# EAGLE design okinesio_v03 (EAGLE 7.5.0)
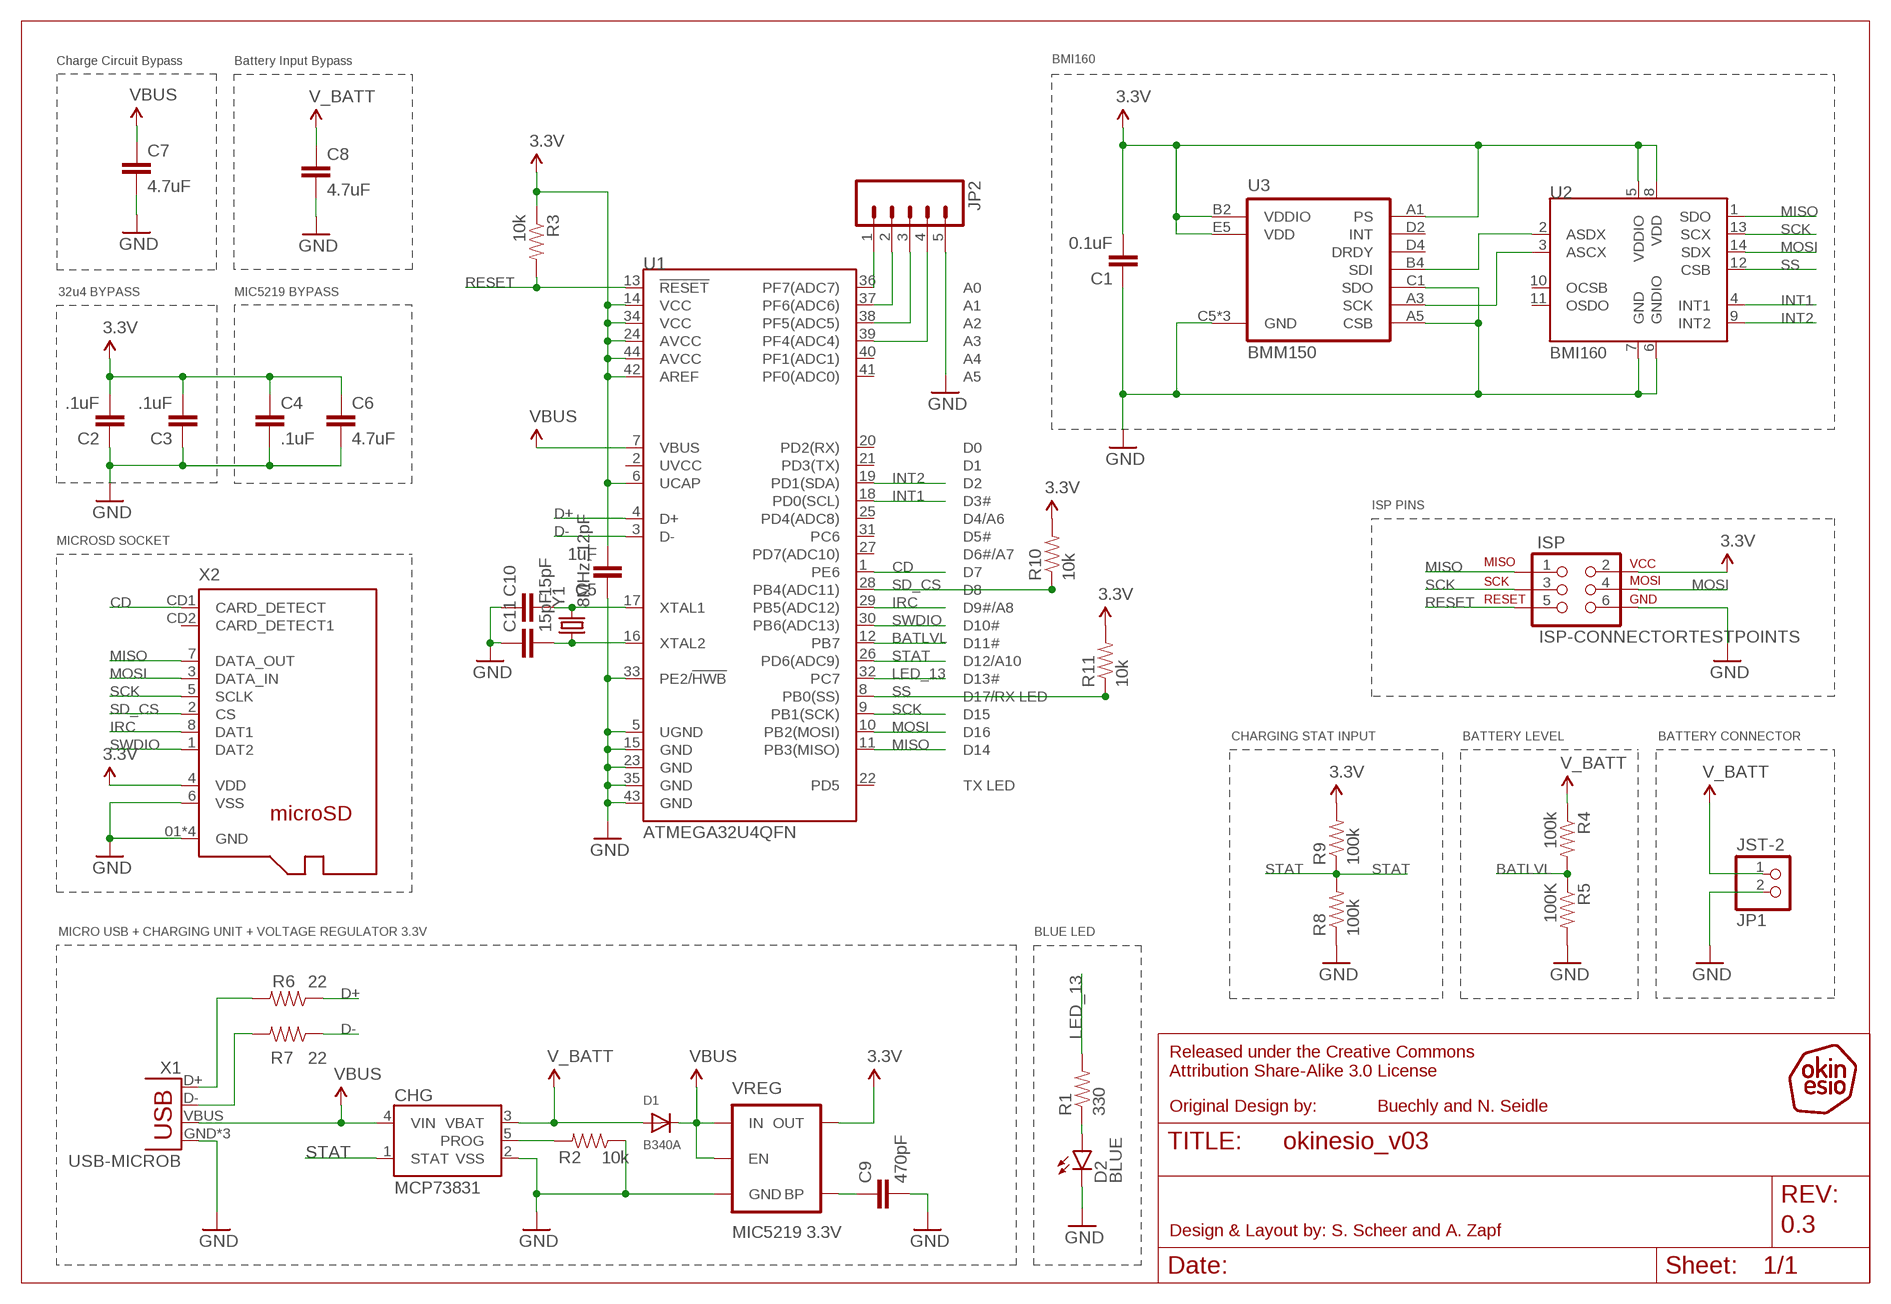
[diagram p0: schematic, sheet 1]

## Parts
C1  0.1uF  CAP0603-CAP  [0603-CAP]
C2  .1uF  CAP0603-CAP  [0603-CAP]
C3  .1uF  CAP0603-CAP  [0603-CAP]
C4  .1uF  CAP0603-CAP  [0603-CAP]
C5  1uF  CAP0603-CAP  [0603-CAP]
C6  4.7uF  CAP0603-CAP  [0603-CAP]
C7  4.7uF  CAP0805  [0805]
C8  4.7uF  CAP0805  [0805]
C9  470pF  CAP0603-CAP  [0603-CAP]
C10  15pF  CAP0603-CAP  [0603-CAP]
C11  15pF  CAP0603-CAP  [0603-CAP]
CHG  MCP73831  [SOT23-5]
D1  B340A  DIODESOD-123  [SOD-123]
D2  BLUE  LED-BLUE0603  [LED-0603]
ISP  ISP-CONNECTORTESTPOINTS  [2X3_TEST_POINTS]
JP1  JST-2  JST_2PIN-THM-RA  [JST-PH-2-THM-RA]
JP2  M05PTH  [1X05]
R1  330  RESISTOR0603  [0603-RES]
R2  10k  RESISTOR0603-RES  [0603-RES]
R3  10k  RESISTOR0603-RES  [0603-RES]
R4  100k  RESISTOR0603-RES  [0603-RES]
R5  100K  RESISTOR0603-RES  [0603-RES]
R6  22  RESISTOR0603-RES  [0603-RES]
R7  22  RESISTOR0603-RES  [0603-RES]
R8  100k  RESISTOR0603-RES  [0603-RES]
R9  100k  RESISTOR0603-RES  [0603-RES]
R10  10k  RESISTOR0603-RES  [0603-RES]
R11  10k  RESISTOR0603-RES  [0603-RES]
U1  ATMEGA32U4QFN  [QFN-44]
U2  BMI160LGA14  [LGA14-BMI160]
U3  BMM150  [WLCSP12-1.56X1.56]
U$4  OKINESIO-LOGO-2.85X2.81MM  [LOGO-STANDARD]
VREG  MIC5219 3.3V  V_REG_MIC52193.3V  [SOT23-5]
X1  USB-MICROB  [USB-MICROB]
X2  MICROSD-SOCKET  [MICROSD-SOCKET]
Y1  8MHz, 12pF  CRYSTALTXC-7A  [CRYSTAL-TXC-7A]

## Nets
3.3V: C1.2 C2.2 C3.2 C4.1 C5.2 C6.1 ISP.2 R3.1 R9.2 R10.2 R11.2 U1.6(UCAP) U1.14(VCC) U1.24(AVCC) U1.34(VCC) U1.42(AREF) U1.44(AVCC) U2.5(VDDIO) U2.8(VDD) U3.A1(PS) U3.B2(VDDIO) U3.E5(VDD) VREG.5(OUT) X2.4(VDD)
5V: C7.1 CHG.4(VIN) D1.C U1.7(VBUS) VREG.1(IN) VREG.3(EN) X1.VBUS ; supply symbol labelled VBUS
BATLVL: R4.2 R5.1 U1.12(PB7)
CD: U1.1(PE6) X2.CD1(CARD_DETECT)
D+: R6.1 U1.4(D+)
D-: R7.1 U1.3(D-)
GND: C1.1 C2.1 C3.1 C4.2 C5.1 C6.2 C7.2 C8.2 C9.2 C10.1 C11.1 CHG.2(VSS) D2.C ISP.6 JP1.2 JP2.5 R2.1 R5.2 R8.1 U1.5(UGND) U1.15(GND) U1.23(GND) U1.33(PE2/!HWB) U1.35(GND) U1.43(GND) U2.6(GNDIO) U2.7(GND) U3.A5(CSB) U3.C1(SDO) U3.C5(GND) U3.E1(GND) U3.E3(GND) VREG.2(GND) X1.GND X1.MT1(GND) X1.MT2(GND) X2.01(GND) X2.02(GND) X2.03(GND) X2.04(GND) X2.6(VSS)
INT1: U1.18(PD0(SCL)) U2.4(INT1)
INT2: U1.19(PD1(SDA)) U2.9(INT2)
IRC: U1.29(PB5(ADC12)) X2.8(DAT1)
LED_13: R1.2 U1.32(PC7)
MISO: ISP.1 U1.11(PB3(MISO)) U2.1(SDO) X2.7(DATA_OUT)
MOSI: ISP.4 U1.10(PB2(MOSI)) U2.14(SDX) X2.3(DATA_IN)
N$1: U2.2(ASDX) U3.B4(SDI)
N$2: JP2.1 U1.36(PF7(ADC7))
N$3: JP2.2 U1.37(PF6(ADC6))
N$4: JP2.3 U1.38(PF5(ADC5))
N$5: C10.2 U1.17(XTAL1) Y1.P$2
N$6: JP2.4 U1.39(PF4(ADC4))
N$7: D2.A R1.1
N$8: U2.3(ASCX) U3.A3(SCK)
N$12: CHG.5(PROG) R2.2
N$15: C9.1 VREG.4(BP)
N$18: C11.2 U1.16(XTAL2) Y1.P$1
N$19: R7.2 X1.D-
N$20: R6.2 X1.D+
RESET: ISP.5 R3.2 U1.13(!RESET)
SCK: ISP.3 U1.9(PB1(SCK)) U2.13(SCX) X2.5(SCLK)
SD_CS: R10.1 U1.28(PB4(ADC11)) X2.2(CS)
SS: R11.1 U1.8(PB0(SS)) U2.12(CSB)
STAT: CHG.1(STAT) R8.2 R9.1 U1.26(PD6(ADC9))
SWDIO: U1.30(PB6(ADC13)) X2.1(DAT2)
V_BATT: C8.1 CHG.3(VBAT) D1.A JP1.1 R4.1
Unconnected: U1.2(UVCC) U1.20(PD2(RX)) U1.21(PD3(TX)) U1.22(PD5) U1.25(PD4(ADC8)) U1.27(PD7(ADC10)) U1.31(PC6) U1.40(PF1(ADC1)) U1.41(PF0(ADC0)) U2.10(OCSB) U2.11(OSDO) U3.D2(INT) U3.D4(DRDY) X2.CD2(CARD_DETECT1)

## Notes on the sheet
- Charge Circuit Bypass | Battery Input Bypass | BMI160
- 32u4 BYPASS | MIC5219 BYPASS
- ISP PINS
- MICROSD SOCKET
- CHARGING STAT INPUT | BATTERY LEVEL | BATTERY CONNECTOR
- MICRO USB + CHARGING UNIT + VOLTAGE REGULATOR 3.3V | BLUE LED
- Released under the Creative Commons
  Attribution Share-Alike 3.0 License
- Original Design by: | Buechly and N. Seidle
- Design & Layout by: S. Scheer and A. Zapf | 0.3

## Library data of the parts
C1 C4 C6-C8 C10 C11 = SparkFun-Capacitors:CAP: Capacitor Standard 0603 ceramic capacitor, and 0.1" leaded capacitor.
C2 = SparkFun-Passives:CAP: Capacitor Standard 0603 ceramic capacitor, and 0.1" leaded capacitor.; PROD_ID: CAP-00810
C3 = SparkFun-Passives:CAP: Capacitor Standard 0603 ceramic capacitor, and 0.1" leaded capacitor.; PROD_ID: CAP-08280
C5 = SparkFun-Passives:CAP: Capacitor Standard 0603 ceramic capacitor, and 0.1" leaded capacitor.; PROD_ID: CAP-00868
C9 = SparkFun-Passives:CAP: Capacitor Standard 0603 ceramic capacitor, and 0.1" leaded capacitor.; PROD_ID: CAP-07884
CHG = SparkFun-PowerIC:MCP73831: Miniature single cell, fully integrated Li-Ion, Li-polymer charge management controller http://ww1.microchip.com/downloads/en/DeviceDoc/20001984g.pdf IC-09995; PROD_ID: IC-09995
D1 = adafruit:DIODE: Diode SMADIODE - SMA Surface Mount Package 20V 1A Schottky Diode Digikey: 641-1014-6-ND DO-1N4148 - Through Hole Small Current Diode SOD-123 20V 1 A (.5mV Vf) Schottky Diode - Digikey: MBRX120TPMSCT-ND SOD-323 10V 570mA (.38mV Vf, 3ns) Schottky Diode - Digikey: ZLLS410CT-ND SOD-523 30V 30mA Schottky Diode (RB751S-40TE61) - Digikey: RB751S-40TE61CT-ND SOT23-R/W - SOT23 Package (R = Solder Paste/Reflow Ovens, W = Hand-Soldering) BAT54Film 40V 300mA - Digikey: 497-7162-1-ND; PROD_ID: DIO-09886
D2 = SparkFun-LED:LED-BLUE: Blue LEDs for production use Various blue LEDs stocked by SparkFun production 0603 - DIO-08575 Rebel - DIO-09553 1206 - DIO-09911; PROD_ID: DIO-08575
ISP = okinesio:ISP-CONNECTOR: AVR ISP 6 Pin A reduced ISP connector for AVR programming. Common on Arduino. This footprint will take up less PCB space. **Special note about "TEST_POINT" package. The stop mask is on the top side, so if you want your programming test points to be on the bottom of your board, make sure to place this package on the bottom side of the board. This also ensure that the orientation to program from the bottom side will be correct. Modified by okinesio. Original design by Sparkfun.com (SparkFun-Connectors.lbr)
JP1 = adafruit:JST_2PIN: JST 2-Pin Connectors of various flavors SMT-RA (S2B-PH-SM4) 4UConnector #17311 SMT (B2B-PH-SM4) THM-RA (S2B-PH) THM (B2B-PH); PROD_ID: CONN-08352
JP2 = SparkFun-Connectors:M05: Header 5 Standard 5-pin 0.1" header. Use with straight break away headers (SKU : PRT-00116), right angle break away headers (PRT-00553), swiss pins (PRT-00743), machine pins (PRT-00117), and female headers (PRT-00115). Molex polarized connector foot print use with SKU : PRT-08230 with associated crimp pins and housings.
R1 = SparkFun-Resistors:RESISTOR: Resistor Basic schematic elements and footprints for 0603, 1206, and PTH resistors.
R2 R3 = SparkFun-Passives:RESISTOR: Resistor Basic schematic elements and footprints for 0603, 1206, and PTH resistors.; PROD_ID: RES-00824
R4 R5 R8-R11 = SparkFun-Passives:RESISTOR: Resistor Basic schematic elements and footprints for 0603, 1206, and PTH resistors.
R6 R7 = SparkFun-Passives:RESISTOR: Resistor Basic schematic elements and footprints for 0603, 1206, and PTH resistors.; PROD_ID: RES-08698
U1 = okinesio:ATMEGA32U4: Atmel 44-pin 8-bit Microcontroller with 32KBytes of ISP Flash and USB Controller
U2 = bosch-sensortec:BMI160: BMI160 Internal Measurement Unit
U3 = bosch-sensortec:BMM150: The BMM150 is a standalone geomagnetic sensor for consumer market applications. It allows measurements of the magnetic field in three perpendicular axes. Based on Bosch’s proprietary FlipCore technology, performance and features of BMM150 are carefully tuned and perfectly match the demanding requirements of all 3-axis mobile applications such as electronic compass, navigation or augmented reality. The library has been designed by Richard Magdycz <https://www.facebook.com/groups/eaglecadsoftUK>
U$4 = okinesio:OKINESIO-LOGO
VREG = SparkFun-PowerIC:V_REG_MIC5219: V_REG MIC5219 Standard 3.3V and 5V 500mA LDO voltage regulator in SOT-23 layout. Micrel part MIC5219. BP (by-pass) pin is used to lower output noise with 470pF cap, may be left open.; PROD_ID: VREG-09872
X1 = SparkFun-Connectors:USB: USB Connectors USB-B-PTH is fully proven SKU : PRT-00139/CONN-08278 USB-miniB is fully proven SKU : PRT-00587 USB-A-PCB is untested. USB-A-H is throughly reviewed, but untested. Spark Fun Electronics SKU : PRT-00437 USB-B-SMT is throughly reviewed, but untested. Needs silkscreen touching up. USB-A-S has not been used/tested USB-MB-H has not been used/tested USB-MICROB has been used. CONN-09505; PROD_ID: CONN-09505
X2 = okinesio:MICROSD-SOCKET: MOLEX 104031-0811 - microSD socket (compact dimensions) 1.10mm Pitch Push-Pull Type 1.42mm Height with Detect Switch Mouser: 538-104031-0811
Y1 = SparkFun-FreqCtrl:CRYSTAL: Various standard crystals. Proven footprints.

## Board
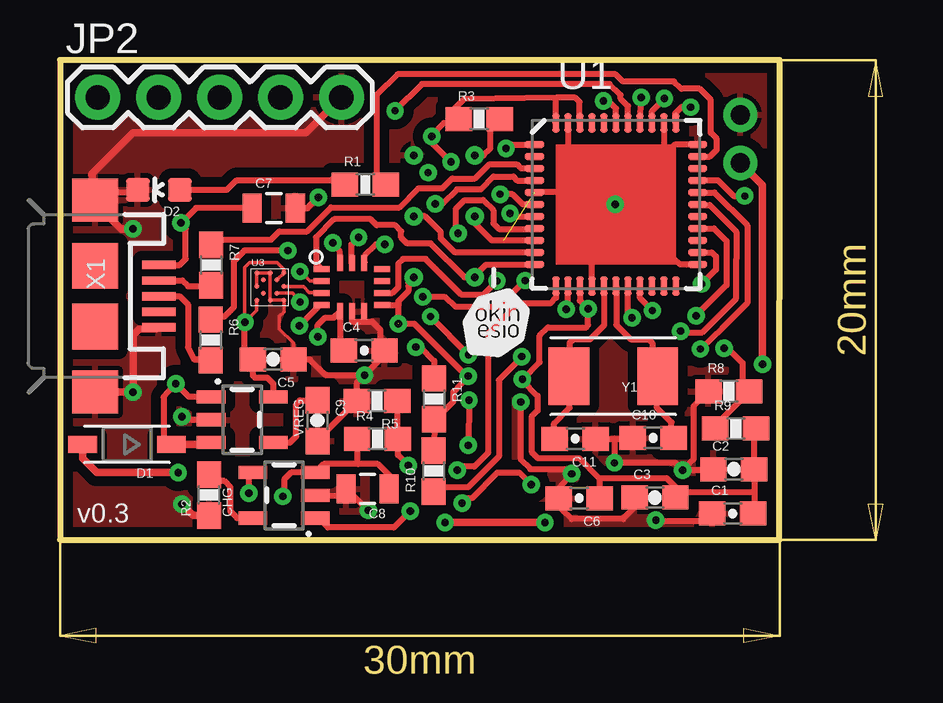
[diagram p1: board, top side]
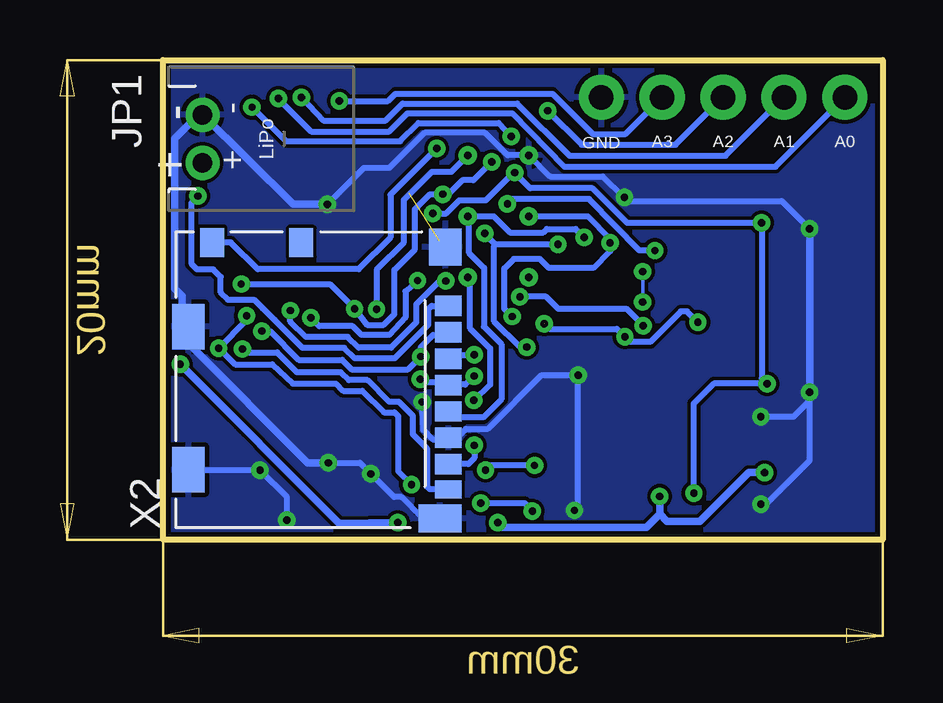
[diagram p2: board, bottom side, seen from below]

Size 30 x 20 mm. Coordinates in mm from the lower left corner, seen from the top.
Outline: 30,0 30,20 0,20 0,0 30,0
Copper layers (1*16): Top 0.035mm / dielectric 1.5mm / Bottom 0.035mm
Design rules "Eagle-DRU LochLP GmbH - 01 and 02 layers - 35mue *": minimum track width 0.15mm, minimum drill 0.3mm, track to track 0.15mm, track to pad 0.15mm, pad to pad 0.15mm, via to via 0.15mm, smd to smd 0.15mm, copper to edge 0.2mm, drill to drill 0.25mm, minimum pad ring 0.23mm, minimum via ring 0.21mm, stop-mask expansion 0.05mm, vias tented up to drill 12mil, thermal gap 0.2mm

### Footprints (pad centres in the part's own frame; a part is rotated, then mirrored left to right if it is on the bottom)
0603-CAP = smd 1.1 x 1: 1 -0.85,0; 2 0.85,0
0805 = smd 0.8 x 1.2: 1 -0.9,0; 2 0.9,0
SOT23-5 = smd 0.55 x 1.2: 1 -0.95,-1.3; 2 0,-1.3; 3 0.95,-1.3; 4 0.95,1.3; 5 -0.95,1.3
SOD-123 = smd 1.2 x 0.7: A 1.85,0; C -1.85,0
LED-0603 = smd 1 x 1: A 0,-0.877; C 0,0.877
2X3_TEST_POINTS = drill 0.305 pad 0.61: 1 -2.54,-1.27; 2 -2.54,1.27; 3 0,-1.27; 4 0,1.27; 5 2.54,-1.27; 6 2.54,1.27
JST-PH-2-THM-RA = drill 0.8 pad 1.422: 1 1,0; 2 -1,0
1X05 = drill 1.016 pad 1.88: 1 0,0; 2 2.54,0; 3 5.08,0; 4 7.62,0; 5 10.16,0
0603-RES = smd 1.1 x 1: 1 -0.85,0; 2 0.85,0
QFN-44 = smd 0.8 x 0.3: 1 -3.4,2.5; 2 -3.4,2; 3 -3.4,1.5; 4 -3.4,1; 5 -3.4,0.5; 6 -3.4,0; 7 -3.4,-0.5; 8 -3.4,-1; 9 -3.4,-1.5; 10 -3.4,-2; 11 -3.4,-2.5; 23 3.4,-2.5; 24 3.4,-2; 25 3.4,-1.5; 26 3.4,-1; 27 3.4,-0.5; 28 3.4,0; 29 3.4,0.5; 30 3.4,1; 31 3.4,1.5; 32 3.4,2; 33 3.4,2.5 | smd 0.3 x 0.8: 12 -2.5,-3.4; 13 -2,-3.4; 14 -1.5,-3.4; 15 -1,-3.4; 16 -0.5,-3.4; 17 0,-3.4; 18 0.5,-3.4; 19 1,-3.4; 20 1.5,-3.4; 21 2,-3.4; 22 2.5,-3.4; 34 2.5,3.4; 35 2,3.4; 36 1.5,3.4; 37 1,3.4; 38 0.5,3.4; 39 0,3.4; 40 -0.5,3.4; 41 -1,3.4; 42 -1.5,3.4; 43 -2,3.4; 44 -2.5,3.4
LGA14-BMI160 = smd 0.675 x 0.25: 1 -1.262,0.75; 2 -1.262,0.25; 3 -1.262,-0.25; 4 -1.262,-0.75; 8 1.262,-0.75; 9 1.262,-0.25; 10 1.262,0.25; 11 1.262,0.75 | smd 0.25 x 0.675: 5 -0.5,-1.012; 6 0,-1.012; 7 0.5,-1.012; 12 0.5,1; 13 0,1; 14 -0.5,1
WLCSP12-1.56X1.56 = smd 0.2 x 0.2: A1 0.6,0.6; A3 0.6,0.034; A5 0.6,-0.532; B2 0.317,0.317; B4 0.317,-0.249; C1 0.034,0.6; C5 0.034,-0.532; D2 -0.249,0.317; D4 -0.249,-0.249; E1 -0.532,0.6; E3 -0.532,0.034; E5 -0.532,-0.532
USB-MICROB = smd 0.35 x 1.4: D+ 0,2.65; D- -0.65,2.65; GND 1.3,2.65; ID 0.65,2.65; VBUS -1.3,2.65 | smd 1.8 x 1.9: MT1 -4,0; MT2 4,0 | smd 1.9 x 1.9: P$1 -1.27,0; P$2 1.27,0
MICROSD-SOCKET = smd 1.55 x 1.35: 01 11.904,0.675 | smd 0.85 x 1.1: 1 9.445,0.55; 2 8.345,0.55; 3 7.245,0.55; 4 6.145,0.55; 5 5.045,0.55; 6 3.945,0.55; 7 2.845,0.55 | smd 1.17 x 1.8: 02 0.585,0.9 | smd 1.9 x 1.35: 03 2.612,11.383; 04 8.582,11.384 | smd 0.75 x 1.1: 8 1.795,0.55 | smd 1.2 x 1: CD1 12.091,10.405; CD2 12.089,6.685
CRYSTAL-TXC-7A = smd 1.7 x 2.4: P$1 1.85,0; P$2 -1.85,0

### Placement (x,y rotation side)
C1  28.05,1.09 0 top
C2  28.09,2.94 0 top
C3  24.8,1.76 0 top
C4  12.68,7.89 0 top
C5  8.89,7.52 180 top
C6  21.65,1.73 180 top
C7  8.91,13.83 0 top
C8  12.82,2.12 180 top
C9  10.73,4.97 270 top
C10  24.73,4.24 0 top
C11  21.48,4.21 180 top
CHG  9.34,1.85 90 top
D1  2.79,3.98 180 top
D2  4.12,14.59 90 top
ISP  16.03,13.49 90 top
JP1  28.36,16.71 270 bottom
JP2  1.57,18.44 0 top
R1  12.73,14.8 0 top
R2  6.22,1.86 90 top
R3  17.48,17.53 0 top
R4  13.24,4.2 0 top
R5  13.22,5.79 180 top
R6  6.28,8.33 270 top
R7  6.31,11.45 270 top
R8  27.89,6.19 0 top
R9  28.17,4.63 0 top
R10  15.58,2.86 90 top
R11  15.59,5.87 270 top
U1  23.18,13.98 0 top
U2  12.17,10.54 0 top
U3  8.73,10.52 0 top
U$4  16.76,7.62 0 top
VREG  7.6,5 270 top
X1  1.47,10.16 270 top
X2  17.56,0.3 90 bottom
Y1  23.07,6.82 180 top

### Tracks (layer width: path | path; a pad name or v marks a point on that pad's centre or on a via)
3.3V  (via drill 0.3 pad 0.2, 0.3 pad 0.25, 0.3 pad 0.41)  (1 unrouted)
  Top 0.152: 9.33,11.23 U3.A1 | U3.B2 U3.A1 | U3.A1 9.33,11.27 9.05,11.56 7.91,11.56 7.71,11.35 v7.71,9.06 8.2,9.56 U3.E5
  Top 0.254: U1.42 21.66,17.39 21.68,17.4 21.67,17.42 21.67,18.26 21.5,18.43 20.68,18.43 | C4.1 11.67,7.89 U2.5 11.41,9.26 11.06,9.26 10.75,8.95 v10.75,8.46 | U2.8 14.09,9.79 14.11,9.77 | 14.1,9.76 14.11,9.77 | U1.6 19.3,13.98 18.87,14.41 v18.35,14.41 | U1.14 21.68,9.97 v22.02,9.63 22.02,8.96 21.95,8.86 20.35,8.86 20,8.51 20,7.4 v19.28,6.69 19.25,6.66 19.91,6 19.91,5.39 19.66,5.13 19.66,3.66 19.91,3.41 21.65,3.41 | v26.74,10.66 27.35,11.26 27.35,11.81 27.18,11.98 U1.24 | 14.11,9.77 v14.11,9.01 14.76,9.01 16.95,6.82 v17.02,6.82 16.4,6.17 16.4,5.76 15.69,5.05 R11.2 15.68,5.01 R10.2 | 22.5,2.56 C6.1 | C3.2 25.66,2.2 | 25.66,2.2 25.3,2.56 22.5,2.56 | v7.71,9.06 7.71,7.86 C5.2 8.05,6.84 8.13,6.76 8.64,6.76 8.89,6.51 VREG.5 | 16.26,17.16 R3.1 16.26,17.19 | U1.34 25.65,17.4 25.65,17.78 25.91,18.04 v26.29,18.04 v26.29,18.03 | 20.65,17.38 U1.44 20.68,18.43 | 20.68,18.43 16.85,18.38 16.26,17.78 16.26,17.19 | 21.65,3.41 22.5,2.56 | R9.2 28.94,4.55 C2.2 28.94,1.99 | v16.3,15.75 15.49,16.56 v15.49,16.82 16,17.38 16.39,17.33 | 16.26,17.19 16.39,17.33 | 16.39,17.33 16.51,17.33 | 28.94,1.99 28.94,1.13 C1.2 | 25.66,2.2 25.87,1.99 28.94,1.99 | 21.65,3.41 | ISP.2 14.53,10.72 14.53,10.57 14.53,10.37 14.11,9.94 14.11,9.77
  Bottom 0.254: v7.71,9.06 8.16,9.52 8.42,9.52 9.69,8.25 10.54,8.25 v10.75,8.46 11.08,8.79 13.89,8.79 v14.11,9.01 | 14.1,9.01 v14.1,9.01 | v17.02,6.82 17.15,6.72 17.41,6.47 18.09,6.47 X2.4 18.17,6.56 19.1,6.56 v19.28,6.69 | v26.74,10.66 23.05,10.66 v22.02,9.63 21.49,8.95 20.8,8.95 20.35,9.4 20.35,11.25 19.5,12.1 19.5,13.78 18.87,14.41 v18.35,14.41 18.11,14.41 17.53,14.99 17.07,14.99 v16.3,15.75 | v26.29,18.03 24.88,16.62 20.12,16.62 19.36,17.38 16,17.38 v15.49,16.82
5V  (via drill 0.3 pad 0.41)
  Top 0.254: v18.76,13.61 18.97,13.48 U1.7 | X1.VBUS 5,11.46 5.25,11.71 5.25,12.96 v5.05,13.21 5.67,13.83 C7.1 | 5.89,5.96 VREG.1 | CHG.4 8.02,2.8 7.87,2.95 v7.87,1.94 | 6.25,6 VREG.1 | 6.35,3.97 6.35,4 VREG.3 6.22,3.98 | VREG.1 6.39,5.96 5.38,5.96 v4.83,6.51 4.32,5.95 4.32,4.11 D1.C
  Top 0.305: D1.C 6.22,3.98
  Bottom 0.254: v18.76,13.61 18.2,13.61 17.65,14.16 16.55,14.16 15.4,15.31 v15.35,15.31 14.7,14.66 12.1,14.66 10.65,13.21 v5.05,13.21 5.05,6.73 v4.83,6.51 7.05,6.51 7.87,5.68 v7.87,1.94
BATLVL  (via drill 0.3 pad 0.41)
  Top 0.254: U1.12 20.68,10.09 20.45,9.86 19.1,9.86 17.85,8.61 17.85,3.63 17.27,3.05 16.76,3.05 v16.56,2.9 | v14.52,3.1 14.09,3.53 R4.2 14.07,3.98 R5.1
  Bottom 0.254: v14.52,3.1 16.36,3.1 v16.56,2.9
CD  (via drill 0.3 pad 0.41)
  Top 0.254: v18.59,16.31 18.83,16.48 U1.1
  Bottom 0.254: X2.CD1 27.18,12.4 26.06,11.28 21.84,11.28 20.52,12.6 20.52,14.38 v18.59,16.31
D+  (via drill 0.3 pad 0.41)
  Top 0.254: v9.5,12.06 7.7,12.06 7.25,11.61 7.25,9.69 6.86,9.3 6.4,9.3 R6.1 | 19.76,14.96 U1.4 19.06,14.98 18.9,15.14 18.08,15.14 17.55,14.61 16.55,14.61 15.95,14.01 v15.65,14.01
  Bottom 0.254: v9.5,12.06 10.15,12.06 12.24,14.21 15.45,14.21 v15.65,14.01
D-
  Top 0.254: 6.27,12.51 R7.1 6.51,12.51 8.79,12.51 9.14,12.86 10.3,12.86 11.3,13.86 14.15,13.86 14.95,14.66 15.95,14.66 16.35,15.06 17.3,15.06 17.9,15.66 19.04,15.66 19.22,15.48 U1.3
GND  (via drill 0.3 pad 0.2, 0.3 pad 0.41)  (1 unrouted)
  Top 0.152: U3.E3 U3.E1 U3.C1 U3.C5 U3.A5 9.33,9.49 9.14,9.3 9.14,8.79 9.74,8.2 C5.1
  Top 0.254: X1.MT1 1.45,14.05 1.42,14.13 | U2.6 12.17,9.1 12.67,9.1 | 12.67,9.1 U2.7 | 25.18,16.02 v23.15,13.99 | v23.15,13.99 21.68,13.99 21.21,14.5 | 21.21,14.5 19.8,14.5 U1.5 | U1.43 21.18,14.62 21.21,14.5 | U1.33 25.64,16.48 25.18,16.02 | U1.35 25.18,16.02 | U1.15 22.18,13.02 v23.15,13.99 | U1.23 25.86,11.48 v23.15,13.99 | 12.67,9.1 13,9.1 13.34,8.76 13.34,8.08 C4.2 | 13.37,7.73 C4.2 | C11.1 23.11,4.21 | 23.11,4.21 23.85,4.21 C10.1 | C5.1 10.41,7.52 11.08,6.86 v12.7,6.86 | C6.2 20.79,1.88 | v25.96,2.9 25.65,3.2 v23.11,3.2 23.11,4.21 | C3.1 23.95,1.35 23.47,0.87 21.34,0.87 20.93,1.27 20.68,1.75 C6.2 | C6.2 20.78,2.12 v21.34,2.75 21.13,2.95 19.61,2.95 19.2,3.36 v19.2,5.74 | VREG.2 5.21,5 v5.08,5.13 | 1.32,6.15 X1.MT2 | 3.14,14.48 1.52,14.48 1.32,14.27 | C7.2 10.31,13.82 v10.77,14.28 | 25.96,3.1 v25.96,2.9 | C2.1 27.2,2.9 v25.96,2.9 | R8.1 26.42,5.57 26.42,3.36 v25.96,2.9 | v12.7,6.86 12.37,6.53 R5.2 10.73,4.16 C9.2 | v12.7,6.86 13.53,7.69 C4.2 | C8.2 11.76,1.85 CHG.2 12.22,1.85 v12.85,1.22 | C1.1 arc-90 26.87,0.77 24.84,0.77 v24.84,0.82
  Top 0.305: X1.GND 4,8.79 3.3,8.79 3.05,8.54 v3.05,6.15 1.32,6.15 | D2.C 3.14,14.48 | 1.32,14.27 X1.MT1 1.32,15.24 3.05,16.97 10.26,16.97 JP2.5 | 1.45,14.05 2.55,12.96 v3.05,12.96 | R2.1 5.54,1.01 v5.08,1.48
  Bottom 0.254: 18.5,12.47 X2.01 | 18.47,0.88 X2.02 | X2.02 18.94,0.89 | X2.02 18.49,0.92 19.2,0.92 20.07,1.78 20.37,1.78 v21.34,2.75 21.79,3.2 v23.11,3.2 | v5.08,5.13 3.71,5.13 3.1,5.74 3.1,6.1 v3.05,6.15 3.05,3.31 4.88,1.48 | X2.04 29.21,9.15 | v3.05,12.96 4.22,14.13 10.62,14.13 v10.77,14.28 10.82,14.28 11.68,15.14 13.87,15.14 ISP.6 15.64,16.03 16.59,16.97 19.1,16.97 20.57,15.5 21.64,15.5 v23.15,13.99 | X2.03 25.98,2.92 v25.96,2.9 24.84,1.78 v24.84,0.82 | 18.18,4.18 17.82,4.18 17.37,4.63 16.46,4.63 14.22,6.86 v12.7,6.86 12.7,1.38 v12.85,1.22 | v19.2,5.74 19.15,4.58 18.76,4.18 18.18,4.18 | 18.18,4.18 X2.6
  Bottom 0.305: X2.04 28.94,8.17 23.98,3.2 v23.11,3.2 | v3.05,12.96 v3.05,6.15 3.15,6.05 | v5.08,1.48 4.88,1.48 | v23.15,13.99 24.58,13.99 JP1.2 28.52,17.71 29.52,16.72 29.52,10.47 29.21,10.16 29.21,9.15
  pour Top (isolate 0.406): -0.25,20.22 -0.25,-0.35 30.23,-0.35 30.23,20.22
  pour Bottom: -0.25,20.22 30.23,20.22 30.23,-0.35 -0.25,-0.35
INT1  (via drill 0.3 pad 0.41)
  Top 0.254: U2.4 10.76,9.79 10.76,9.7 v9.98,8.92 | v23.85,9.26 23.68,9.43 U1.18 | v19.39,10.81 18.29,9.71 16.5,9.71 16.02,10.13 v15.13,10.13
  Bottom 0.254: v15.13,10.13 14.04,10.13 13.54,9.63 10.69,9.63 v9.98,8.92 | v23.85,9.26 23.5,8.91 22.1,8.91 21.73,8.54 20.56,8.54 19.9,9.26 19.9,10.35 v19.39,10.81
INT2  (via drill 0.3 pad 0.41)
  Top 0.254: U2.9 13.86,10.29 14.11,10.53 14.1,10.54 14.1,11.51 14.3,11.71 15.25,11.71 16.72,10.23 17.66,10.23 v18.22,10.79 | v24.7,9.56 24.18,10.08 U1.19
  Bottom 0.254: v24.7,9.56 24.7,9.11 24.05,8.46 22.3,8.46 21.85,8.01 20.5,8.01 19.45,9.06 19.45,9.81 18.48,10.78 v18.22,10.79
IRC  (via drill 0.3 pad 0.41)
  Top 0.254: v26.7,7.95 26.74,8 27.6,8.81 28.65,9.86 28.65,13.11 27.28,14.48 U1.29
  Bottom 0.254: X2.8 18.88,2.1 19,2.22 19,3.81 19.59,4.41 19.59,5.17 20.17,5.75 20.57,5.75 21.49,6.66 22.27,6.66 22.59,6.98 24.42,6.98 25.24,7.81 26.5,7.81 v26.7,7.95
LED_13
  Top 0.254: U1.32 27.1,15.98 27.38,16.26 27.38,16.72 27.13,16.97 27.13,18.34 26.67,18.8 25.91,18.8 25.6,19.11 23.47,19.11 23.16,19.41 14.07,19.41 13.21,18.55 13.21,15.12 R1.2
MISO  (via drill 0.3 pad 0.41)
  Top 0.254: U1.11 19.76,11.46 17.75,11.46 17.3,11.01 ISP.1 16.86,10.95 15.45,12.35 14.48,12.35 14.22,12.6 14.22,12.86 13.97,13.11 13.21,13.11 12.95,13.37 11.43,13.37 10.67,12.6 10.67,11.52 U2.1 | v17.05,5.82 v17.02,3.93
  Bottom 0.254: 18.09,3.17 X2.7 17.27,3.15 17.02,3.4 v17.02,3.93 | v17.05,5.82 16.37,6.47 16.37,7.98 17.2,8.81 17.2,10.85 ISP.1
MOSI  (via drill 0.3 pad 0.41)
  Top 0.254: U1.10 16.47,11.98 15.88,12.57 15.88,12.82 15.22,13.49 ISP.4 | v17.03,7.71 v15.45,9.3 | U2.14 11.67,12 v11.37,12.38
  Bottom 0.254: X2.3 18,7.7 v17.03,7.71 | v15.45,9.3 15.77,9.63 15.77,11.31 15.37,11.71 14.3,11.71 13.92,11.33 12.07,11.33 11.37,12.03 v11.37,12.38 11.37,12.56 12.3,13.49 ISP.4
N$1  (via drill 0.3 pad 0.15)
  Top 0.152: U2.2 10.42,10.79 10.13,11.08 v10.01,11.18 | U3.B4 9.69,10.28 v10.01,9.91
  Bottom 0.152: v10.01,9.91 v10.01,11.18
N$2  (via drill 0.3 pad 0.41)
  Top 0.254: U1.36 24.68,17.88 v25.2,18.39
  Bottom 0.254: v25.2,18.39 23.82,17.02 20.57,17.02 19.81,17.78 15.44,17.78 13.26,15.55 4.47,15.55 JP2.1
N$3  (via drill 0.3 pad 0.41)
  Top 0.254: U1.37 v24.23,18.44
  Bottom 0.254: v24.23,18.44 23.32,17.48 20.73,17.48 20.02,18.19 15.24,18.19 13.06,16.01 6.55,16.01 JP2.2
N$4  (via drill 0.3 pad 0.41)
  Top 0.254: U1.38 23.68,18.08 23.37,18.39 23.37,18.55 22.91,19 15.09,19 v13.97,17.89
  Bottom 0.254: v13.97,17.89 12.55,16.46 8.64,16.46 JP2.3
N$5
  Top 0.254: U1.17 23.2,10.58 23.2,8.96 23.8,8.36 24.55,8.36 24.7,8.21 24.7,7.04 Y1.P$2 24.92,6.03 24.89,6 24.89,5.49 25.49,4.89 25.49,4.33 C10.2 25.55,4.27
N$6  (via drill 0.3 pad 0.41)
  Top 0.254: U1.39 23.18,17.97 22.86,18.29 v22.66,18.29
  Bottom 0.254: v22.66,18.29 20.62,18.29 20.32,18.6 13.77,18.6 12.09,16.92 10.72,16.92 JP2.4
N$7
  Top 0.254: D2.A 6.97,14.59 7.37,14.99 11.34,14.99
  Top 0.305: 11.34,14.99 R1.1
N$8
  Top 0.152: U3.A3 10.15,10.56 10.39,10.32 10.88,10.32 U2.3
N$12
  Top 0.254: CHG.5 7.38,0.9 7.11,1.17 7.11,2.19 6.86,2.44 6.49,2.44 R2.2
N$15
  Top 0.254: VREG.4 9.59,4.05 9.85,4.31 9.85,5.66 10,5.81 10.47,5.81 C9.1
N$18
  Top 0.254: U1.16 22.68,8.94 22.1,8.36 21.4,8.36 21.25,8.21 21.25,6.85 Y1.P$1 21.22,6.09 21.25,6.06 21.25,5.51 20.6,4.86 20.6,4.25 C11.2
N$19
  Top 0.254: X1.D- 5.1,10.81 5.33,10.57 6.28,10.57 R7.2
N$20
  Top 0.254: X1.D+ 4.99,10.16 5.33,9.81 5.33,8.03 5.59,7.52 5.73,7.52 R6.2
RESET  (via drill 0.3 pad 0.41)
  Top 0.254: v21.1,9.6 21.18,9.7 U1.13 | ISP.5 17.66,16.03 17.95,16.31 17.95,17.15 R3.2
  Bottom 0.254: ISP.5 17.31,16.01 17.98,15.35 18.79,15.35 19.96,14.18 19.96,12.39 21.09,11.26 v21.1,9.6
SCK  (via drill 0.3 pad 0.41)
  Top 0.254: U1.9 18,12.48 17.3,13.19 ISP.3 | U2.13 12.15,11.55 12.15,12.31 v12.45,12.61
  Bottom 0.254: v12.45,12.61 12.8,12.96 14,12.96 14.15,12.81 15.55,12.81 16.22,13.49 ISP.3 17.25,13.44 17.25,11.96 16.62,11.33 16.62,8.89 15.9,8.16 15.9,5.86 16.65,5.11 17.61,5.11 X2.5
SD_CS  (via drill 0.3 pad 0.41)
  Top 0.254: U1.28 26.6,13.96 27.09,13.96 28.19,12.86 28.19,11.69 | v19.25,7.64 19.25,7.62 18.3,6.66 18.3,3.47 17.02,2.19 15.76,2.19 R10.1 15.91,1.68 | v25.88,8.7 25.99,8.64 26.77,8.64 28.19,10.06 28.19,11.69 | 28.19,11.69 28.2,11.69
  Bottom 0.254: X2.2 18.12,8.54 18.75,8.54 19.25,8.03 v19.25,7.64 19.78,7.11 22.15,7.11 22.54,7.5 24.34,7.5 25.54,8.7 v25.88,8.7
SS  (via drill 0.3 pad 0.41)
  Top 0.254: U1.8 19.76,12.96 18.3,12.96 18.07,13.19 18.07,13.74 17.64,14.16 16.87,14.15 16.5,13.79 16.5,12.87 v16.6,12.77 | U2.12 12.7,11.57 12.7,11.84 13.17,12.31 v13.54,12.31 | v14.84,8.03 15.02,8.03 15.6,7.46 R11.1
  Bottom 0.254: v13.54,12.31 16.14,12.31 | 16.14,12.31 v16.6,12.77 | v14.84,8.03 15.12,8.03 16.2,9.11 16.2,12.25 16.14,12.31
STAT  (via drill 0.3 pad 0.41)
  Top 0.254: U1.26 27.26,12.98 27.79,12.45 27.79,10.61 v26.52,9.34 | v16.76,1.53 16.97,1.73 17.17,1.73 18.24,2.8 19.15,2.8 v19.64,2.3 | v27.69,7.98 27.84,7.98 28.45,7.37 28.45,6.48 R8.2 27.32,4.77 R9.1 | v14.61,1.2 13.92,0.51 11.18,0.51 10.79,0.9 CHG.1
  Bottom 0.254: v19.64,2.3 20.21,2.86 20.21,5.16 20.36,5.31 20.8,5.31 21.7,6.21 22.5,6.21 22.8,6.51 24.6,6.51 25.45,7.31 27,7.31 27.69,8 v27.69,7.98 26.52,9.15 v26.52,9.34 | v16.76,1.53 14.94,1.53 v14.61,1.2
SWDIO  (via drill 0.3 pad 0.41)
  Top 0.254: 26.6,15 U1.30 | 26.6,14.96 U1.30 | v28.55,14.33 28.09,14.33 27.44,14.98 U1.30
  Bottom 0.254: 18.09,9.77 X2.1 | X2.1 18.11,9.52 | X2.1 18.8,9.75 18.95,9.61 18.95,8.96 20.35,7.56 22,7.56 22.45,8 24.19,8 25.35,9.16 25.86,9.66 26.21,10.01 27.3,10.01 27.59,10.31 27.59,10.96 27.91,11.27 28.59,11.27 28.8,11.48 28.8,14.08 v28.55,14.33
V_BATT  (via drill 0.3 pad 0.41)
  Top 0.254: v9.3,1.81 9.35,1.86 9.35,2.51 9.64,2.8 CHG.3 11,3.15 12.45,3.15 | v9.3,1.81 | C8.1 13.82,2.59 13.26,3.15 12.45,3.15 | R4.1 12.39,3.21 12.45,3.15
  Top 0.305: D1.A 0.94,3.38 1.52,2.8 v4.93,2.8 | v20.22,0.71 v16.05,0.71 | JP1.1 29.29,14.79 v29.29,7.32
  Bottom 0.254: v9.3,1.81
  Bottom 0.305: v4.93,2.8 5.59,2.8 7.62,0.77 8.99,0.77 9.3,1.07 | 9.3,1.07 v9.3,1.81 | v20.22,0.71 22.66,0.69 v29.29,7.32 | v16.05,0.71 15.85,0.51 9.86,0.51 9.3,1.07

### Text on the board
tPlace: v0.3
bPlace: - | LiPo | A0 | A1 | A2 | A3 | GND | +